# Altium project pag7936.PrjPcb
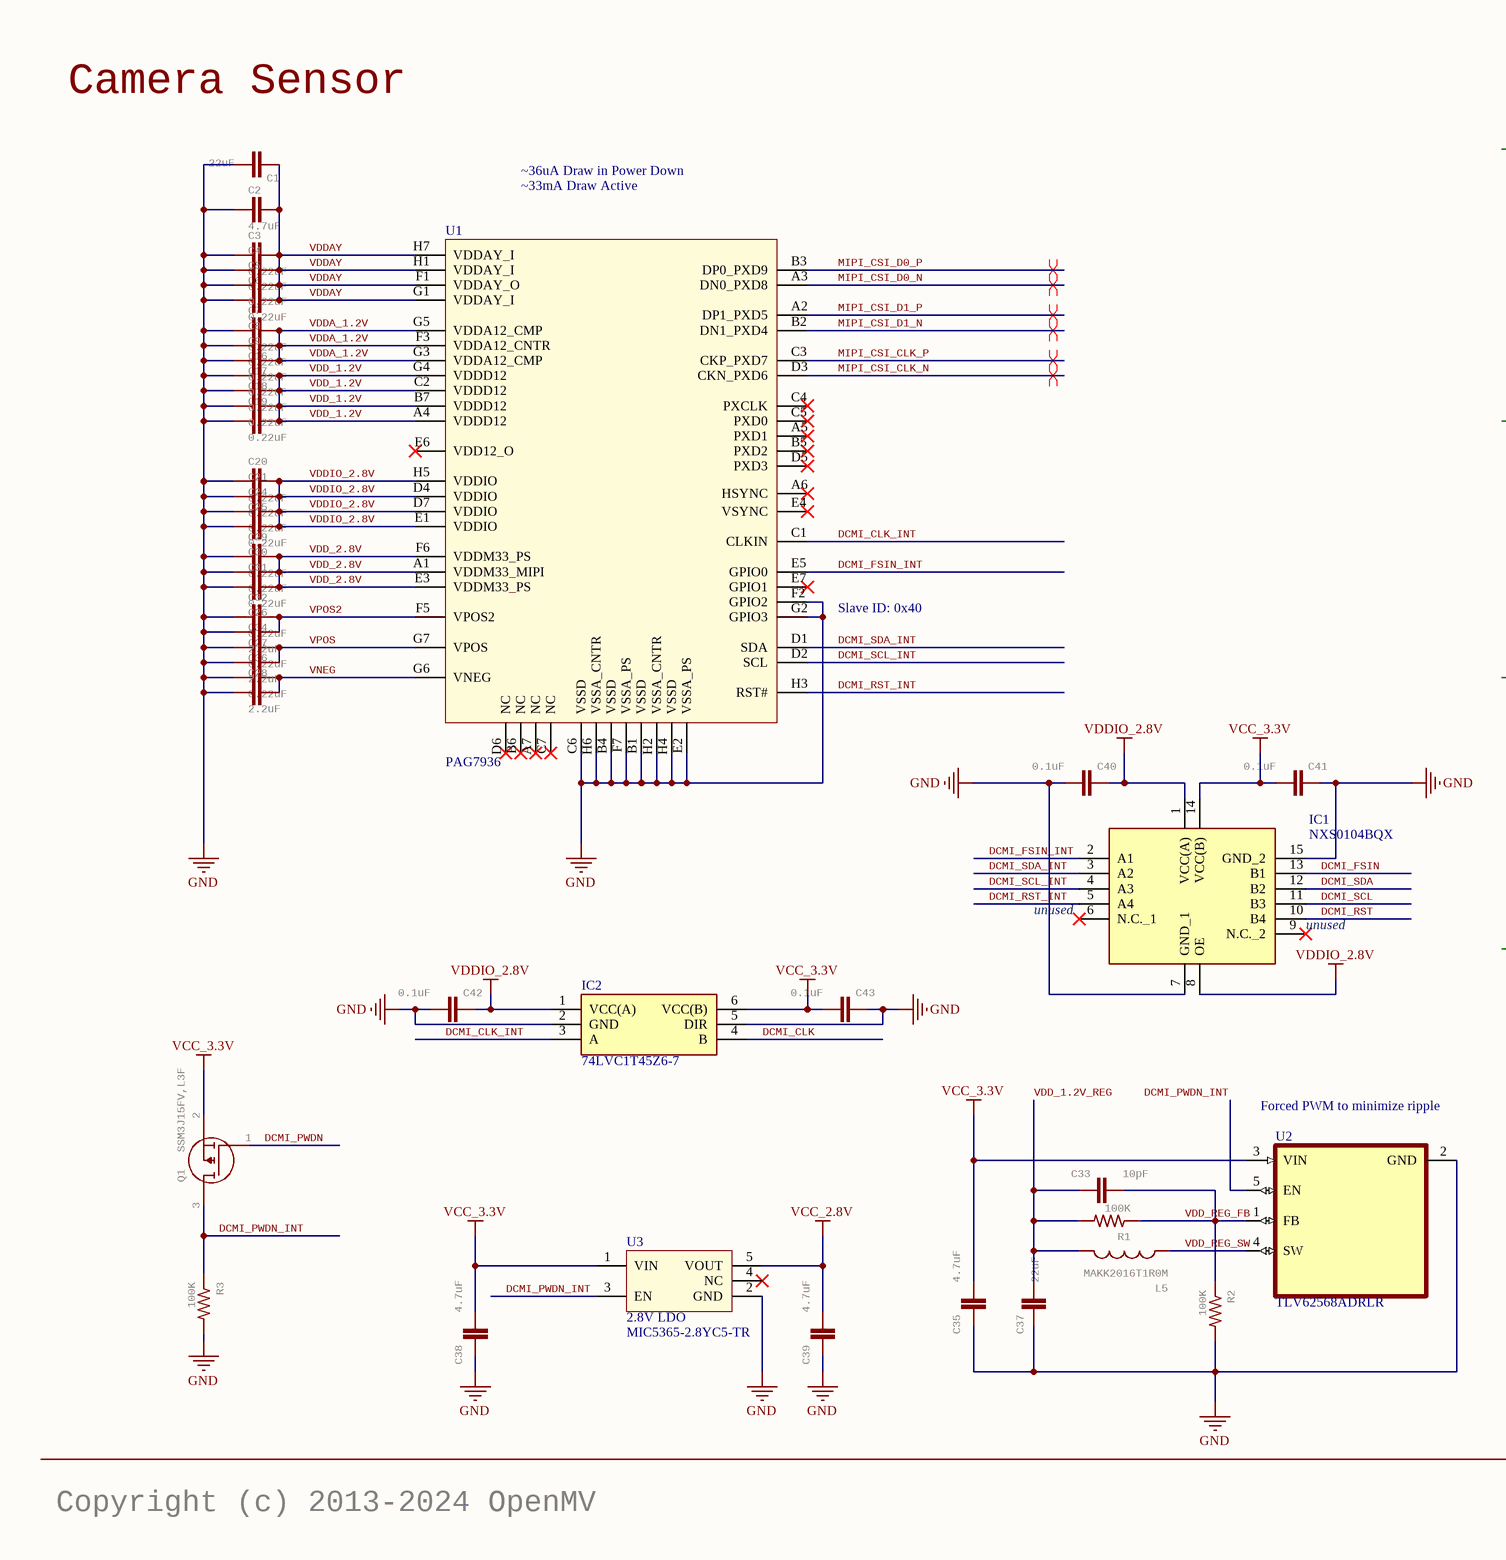
[diagram p0: pag7936.SchDoc, left]
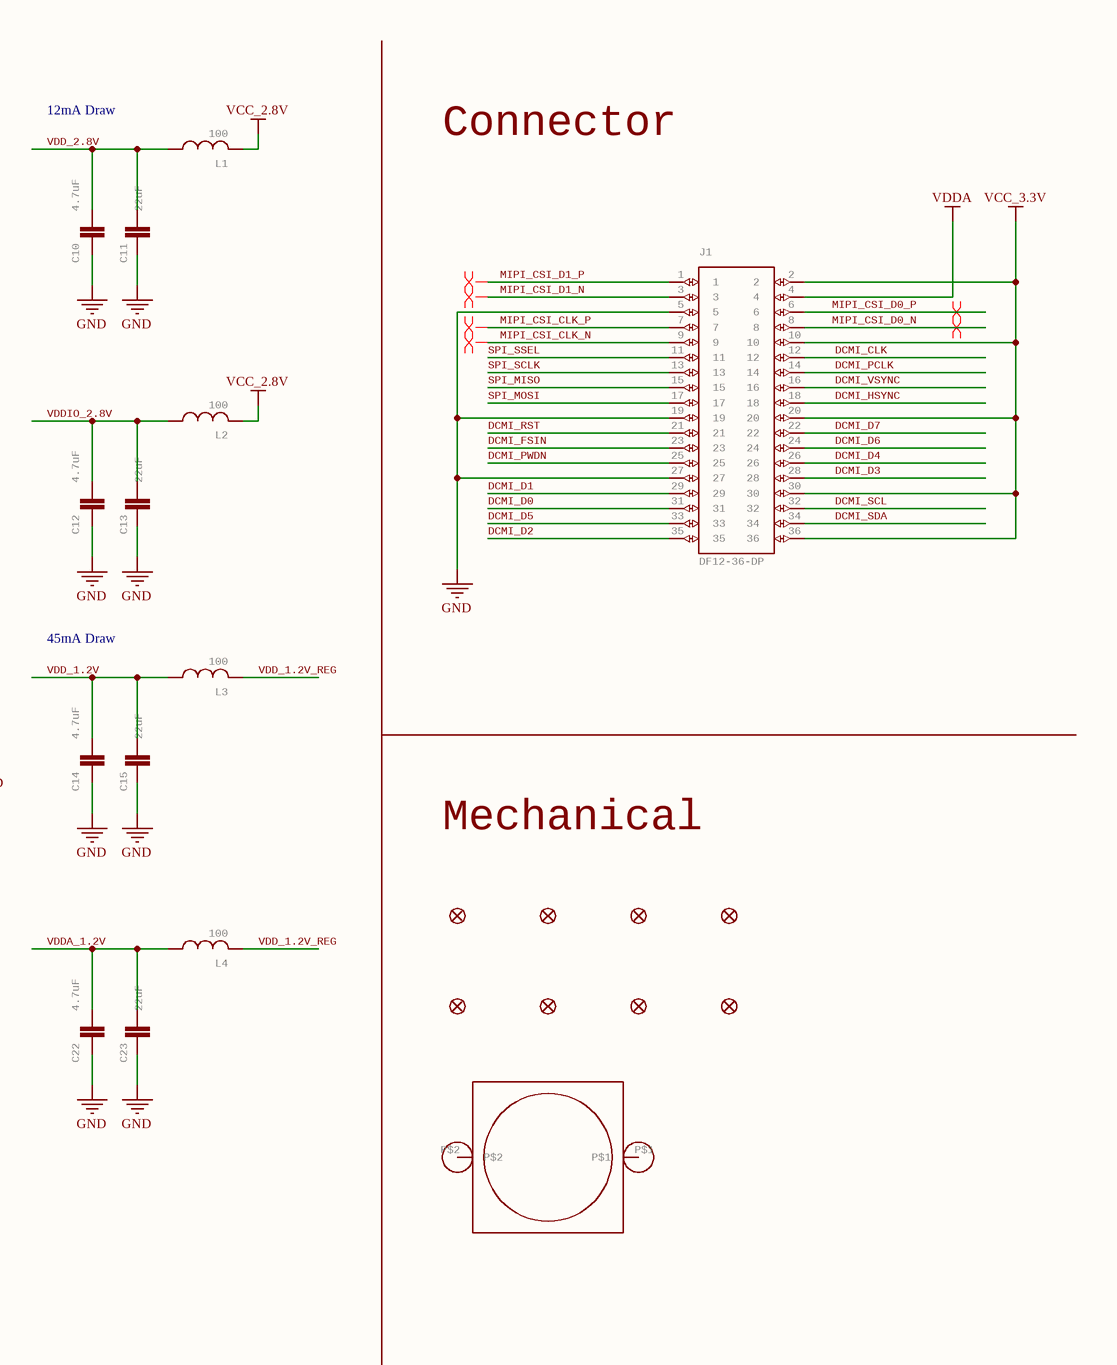
[diagram p1: pag7936.SchDoc, right]
1 sheet, 67 parts. Net scope: global (net labels, ports and power ports of the same name join across sheets).
Board file: pag7936.PcbDoc

## Sheet pag7936.SchDoc: hd-gs-alt
size 453 x 317 mm; Origin: Eagle; Date: 5/1/2023 6:37:17 AM; SheetNumber: 1; GateName_1: G$1; SymbolName_1: FRAME_B_L; LibraryName: frames; DeviceSetName: FRAME_B_L; GateName_2: G$2; SymbolName_2: DOCFIELD; Sheet: Sheet:; REV: REV:

### Parts
C1  22uF  [0805]
C2  4.7uF  [0402-CAP]
C3  0.22uF  [C0201]
C4  0.22uF  [C0201]
C5  0.22uF  [C0201]
C6  0.22uF  [C0201]
C7  0.22uF  [C0201]
C8  0.22uF  [C0201]
C9  0.22uF  [C0201]
C10  4.7uF  [0402-CAP]
C11  22uF  [0805]
C12  4.7uF  [0402-CAP]
C13  22uF  [0805]
C14  4.7uF  [0402-CAP]
C15  22uF  [0805]
C16  0.22uF  [C0201]
C17  0.22uF  [C0201]
C18  0.22uF  [C0201]
C19  0.22uF  [C0201]
C20  0.22uF  [C0201]
C21  0.22uF  [C0201]
C22  4.7uF  [0402-CAP]
C23  22uF  [0805]
C24  0.22uF  [C0201]
C25  0.22uF  [C0201]
C26  2.2uF  [0402-CAP]
C27  2.2uF  [0402-CAP]
C28  2.2uF  [0402-CAP]
C29  0.22uF  [C0201]
C30  0.22uF  [C0201]
C31  0.22uF  [C0201]
C32  0.22uF  [C0201]
C33  10pF  [0402-CAP]
C34  0.22uF  [C0201]
C35  4.7uF  [0402-CAP]
C36  0.22uF  [C0201]
C37  22uF  [0805]
C38  4.7uF  [0402-CAP]
C39  4.7uF  [0402-CAP]
C40  0.1uF  [0402-CAP]
C41  0.1uF  [0402-CAP]
C42  0.1uF  [0402-CAP]
C43  0.1uF  [0402-CAP]
FD1  FIDUCIAL1X2  [FIDUCIAL-1X2]  (value not drawn)
FD2  FIDUCIAL1X2  [FIDUCIAL-1X2]  (value not drawn)
FD3  FIDUCIAL1X2  [FIDUCIAL-1X2]  (value not drawn)
FD4  FIDUCIAL1X2  [FIDUCIAL-1X2]  (value not drawn)
FD5  FIDUCIAL1X2  [FIDUCIAL-1X2]  (value not drawn)
FD6  FIDUCIAL1X2  [FIDUCIAL-1X2]  (value not drawn)
FD7  FIDUCIAL1X2  [FIDUCIAL-1X2]  (value not drawn)
FD8  FIDUCIAL1X2  [FIDUCIAL-1X2]  (value not drawn)
H1  LENSMOUNT20MM  [LENSMOUNT-20MM]  (value not drawn)
IC1  NXS0104BQX  [NXS0104BQX]
IC2  74LVC1T45Z6-7  [74LVC1T45Z67]
J1  DF12-36-DP  [DF12-36-DP]
L1  100  [0402]
L2  100  [0402]
L3  100  [0402]
L4  100  [0402]
L5  MAKK2016T1R0M  [INDC2016X100N]
Q1  SSM3J15FV,L3F  [SSM3J15FV]
R1  100K  [R0402]
R2  100K  [R0402]
R3  100K  [R0402]
U1  PAG7936  [PAG7936]
U2  TLV62568ADRLR  [SOT50P160X60-6N]
U3  2.8V LDO  MPN: MIC5365-2.8YC5-TR  [SC70-5]

### Nets
GND: C1.2 C2.2 C3.1 C4.1 C5.1 C6.1 C7.1 C8.1 C9.1 C10.1 C11.1 C12.1 C13.1 C14.1 C15.1 C16.1 C17.1 C18.1 C19.1 C20.1 C21.1 C22.1 C23.1 C24.1 C25.1 C26.2 C27.2 C28.2 C29.1 C30.1 C31.1 C32.1 C34.1 C35.1 C36.1 C37.1 C38.1 C39.1 C40.2 C41.1 C42.2 C43.1 IC1.7(GND_1) IC1.15(GND_2) IC2.2(GND) IC2.5(DIR) J1.5 J1.19 J1.27 R2.2 R3.2 U1.B1(VSSD) U1.B4(VSSD) U1.C6(VSSD) U1.E2(VSSA_PS) U1.F2(GPIO2) U1.F7(VSSA_PS) U1.G2(GPIO3) U1.H2(VSSA_CNTR) U1.H4(VSSD) U1.H6(VSSA_CNTR) U2.2(GND) U3.2(GND)
VCC_2.8V: C39.2 L1.2(P$2) L2.2(P$2) U3.5(VOUT)
VCC_3.3V: C35.2 C38.2 C41.2 C43.2 IC1.14(VCC(B)) IC2.6(VCC(B)) J1.2 J1.10 J1.20 J1.30 J1.36 Q1.2(S) U2.3(VIN) U3.1(VIN)
VDDA: J1.4
VDDIO_2.8V: C12.2 C13.2 C20.2 C21.2 C24.2 C25.2 C40.1 C42.1 IC1.1(VCC(A)) IC1.8(OE) IC2.1(VCC(A)) L2.1(P$1) U1.D4(VDDIO) U1.D7(VDDIO) U1.E1(VDDIO) U1.H5(VDDIO)
DCMI_CLK: IC2.4(B) J1.12
DCMI_CLK_INT: IC2.3(A) U1.C1(CLKIN)
DCMI_D0: J1.31
DCMI_D1: J1.29
DCMI_D2: J1.35
DCMI_D3: J1.28
DCMI_D4: J1.26
DCMI_D5: J1.33
DCMI_D6: J1.24
DCMI_D7: J1.22
DCMI_FSIN: IC1.13(B1) J1.23
DCMI_FSIN_INT: IC1.2(A1) U1.E5(GPIO0)
DCMI_HSYNC: J1.18
DCMI_PCLK: J1.14
DCMI_PWDN: J1.25 Q1.1(G)
DCMI_PWDN_INT: Q1.3(D) R3.1 U2.5(EN) U3.3(EN)
DCMI_RST: IC1.10(B4) J1.21
DCMI_RST_INT: IC1.5(A4) U1.H3(RST#)
DCMI_SCL: IC1.11(B3) J1.32
DCMI_SCL_INT: IC1.4(A3) U1.D2(SCL)
DCMI_SDA: IC1.12(B2) J1.34
DCMI_SDA_INT: IC1.3(A2) U1.D1(SDA)
DCMI_VSYNC: J1.16
MIPI_CSI_CLK_N: J1.9 U1.D3(CKN_PXD6)
MIPI_CSI_CLK_P: J1.7 U1.C3(CKP_PXD7)
MIPI_CSI_D0_N: J1.8 U1.A3(DN0_PXD8)
MIPI_CSI_D0_P: J1.6 U1.B3(DP0_PXD9)
MIPI_CSI_D1_N: J1.3 U1.B2(DN1_PXD4)
MIPI_CSI_D1_P: J1.1 U1.A2(DP1_PXD5)
SPI_MISO: J1.15
SPI_MOSI: J1.17
SPI_SCLK: J1.13
SPI_SSEL: J1.11
VDD_1.2V: C14.2 C15.2 C16.2 C17.2 C18.2 C19.2 L3.1(P$1) U1.A4(VDDD12) U1.B7(VDDD12) U1.C2(VDDD12) U1.G4(VDDD12)
VDD_1.2V_REG: C33.1 C37.2 L3.2(P$2) L4.2(P$2) L5.2 R1.2
VDD_2.8V: C10.2 C11.2 C29.2 C30.2 C31.2 L1.1(P$1) U1.A1(VDDM33_MIPI) U1.E3(VDDM33_PS) U1.F6(VDDM33_PS)
VDD_REG_FB: C33.2 R1.1 R2.1 U2.1(FB)
VDD_REG_SW: L5.1 U2.4(SW)
VDDA_1.2V: C7.2 C8.2 C9.2 C22.2 C23.2 L4.1(P$1) U1.F3(VDDA12_CNTR) U1.G3(VDDA12_CMP) U1.G5(VDDA12_CMP)
VDDAY: C1.1 C2.1 C3.2 C4.2 C5.2 C6.2 U1.F1(VDDAY_O) U1.G1(VDDAY_I) U1.H1(VDDAY_I) U1.H7(VDDAY_I)
VNEG: C28.1 C36.2 U1.G6(VNEG)
VPOS: C27.1 C34.2 U1.G7(VPOS)
VPOS2: C26.1 C32.2 U1.F5(VPOS2)

Not connected (* = marked no-connect by the designer): H1 P$1 P$2; IC1 6(N.C._1)* 9(N.C._2)*; U1 A5(PXD1)* A6(HSYNC)* A7(NC)* B5(PXD2)* B6(NC)* C4(PXCLK)* C5(PXD0)* C7(NC)* D5(PXD3)* D6(NC)* E4(VSYNC)* E6(VDD12_O)* E7(GPIO1)*; U3 4(NC)*

### Layout directives
differential pair; differential pair class MIPI: MIPI_CSI_CLK_N, MIPI_CSI_CLK_P, MIPI_CSI_D0_N, MIPI_CSI_D0_P, MIPI_CSI_D1_N, MIPI_CSI_D1_P
differential pair: MIPI_CSI_CLK_N, MIPI_CSI_CLK_P, MIPI_CSI_D0_N, MIPI_CSI_D0_P, MIPI_CSI_D1_N, MIPI_CSI_D1_P

### Notes on the sheet
- Camera Sensor
- 12mA Draw
- ~36uA Draw in Power Down
- ~33mA Draw Active
- Connector
- Slave ID: 0x40
- 45mA Draw
- Mechanical
- (near IC1) unused
- (near U2) Forced PWM to minimize ripple
- Copyright (c) 2013-2024 OpenMV

### Library data of the parts
C1 C11 C13 C15 C23 C37 = 22UF-0805-6.3V-20%: 22ÂµF ceramic capacitors    A capacitor is a passive two-terminal electrical component used to store electrical energy temporarily in an electric field.; MPN: CL21A226MQQNNNE; GateName_1: G$1; SymbolName_1: CAP; PROD_ID: CAP-08402; DeviceName: -0805-6.3V-20%; LibraryName: SparkFun-Capacitors; DeviceSetName: 22UF
C2 = CAP0402-CAP: CapacitorStandard 0603 ceramic capacitor, and 0.1" leaded capacitor.; MPN: JMK105BBJ475MV-F; GateName_1: G$1; SymbolName_1: CAP; DeviceName: 0402-CAP; LibraryName: sfe; DeviceSetName: CAP; Part Number: JMK105BBJ475MV-F
C3-C9 C16-C21 C24 C25 C29-C32 C34 C36 = C-EUC0201: CAPACITOR, European symbol; MPN: GRM033R60J224ME15D; GateName_1: G$1; SymbolName_1: C-EU; POPULARITY: 0; DeviceName: C0201; LibraryName: rcl; DeviceSetName: C-EU; SPICEPREFIX: C; Part Number: GRM033R60J224ME15D
C10 C12 C14 C22 C35 C38 C39 = CAP_0402: 0402 (1005 Metric) Nick Garner - TeleSense; MPN: JMK105BBJ475MV-F; GateName_1: G$1; SymbolName_1: CAP; LibraryName: 0402; DeviceSetName: CAP_0402
C26-C28 = CAP0402-CAP: CapacitorStandard 0603 ceramic capacitor, and 0.1" leaded capacitor.; MPN: CL05A225MQ5NNNC; GateName_1: G$1; SymbolName_1: CAP; DeviceName: 0402-CAP; LibraryName: sfe; DeviceSetName: CAP; Part Number: CL05A225MQ5NNNC
C33 = CAP_0402: 0402 (1005 Metric) Nick Garner - TeleSense; MPN: 0402N100D500CT; GateName_1: G$1; SymbolName_1: CAP; LibraryName: 0402; DeviceSetName: CAP_0402
C40-C43 = C-EUC0201: CAPACITOR, European symbol; MPN: C0402C104Z4VAC; GateName_1: G$1; SymbolName_1: C-EU; POPULARITY: 0; LibraryName: rcl; DeviceSetName: C-EU; SPICEPREFIX: C; Part Number: C0402C104Z4VAC
FD1-FD8 = FIDUCIAL1X2: Fiducial Alignment Points    Point-of-reference for pick-and-place machines and other optical instruments.; GateName_1: G$1; DeviceName: 1X2; SymbolName_1: FIDUCIAL; LibraryName: SparkFun-Aesthetics; DeviceSetName: FIDUCIAL
H1 = LENSMOUNT20MM: GateName_1: G$1; SymbolName_1: LENS; DeviceName: 20MM; LibraryName: lensmount; DeviceSetName: LENSMOUNT
IC1 = CMP-057-000000-1: NXS0104 - Dual supply translating transceiver; open drain; autodirectionsensing@en-us; Manufacturer_Name: Nexperia; Height: 1mm; Source: SamacSys.SchLib; Mouser Part Number: 771-NXS0104BQX; Manufacturer_Part_Number: NXS0104BQX; Datasheet Link: https://assets.nexperia.com/documents/data-sheet/NXS0104.pdf; Mouser Price/Stock: https://www.mouser.co.uk/ProductDetail/Nexperia/NXS0104BQX?qs=2WXlatMagcEya%2F7vq6wExg%3D%3D; Design Item ID: NXS0104BQX; <PN: NXS0104BQX; Part Number: NXS0104BQX; MPN: NXS0104BQX
IC2 = 74LVC1T45Z6-7: Integrated Circuit; Manufacturer_Name: Diodes Incorporated; Datasheet Link: https://www.diodes.com//assets/Datasheets/74LVC1T45.pdf; Height: 0.6mm; Manufacturer_Part_Number: 74LVC1T45Z6-7; Mouser Part Number: 621-74LVC1T45Z6-7; Mouser Price/Stock: https://www.mouser.co.uk/ProductDetail/Diodes-Incorporated/74LVC1T45Z6-7?qs=Oxncjon6mbri043VV7aCkA%3D%3D; Arrow Part Number: 74LVC1T45Z6-7; Arrow Price/Stock: https://www.arrow.com/en/products/74lvc1t45z6-7/diodes-incorporated?region=nac
J1 = DF12-36-DP: MPN: DF12NB(3.0)-36DP-0.5V(51); GateName_1: G$1; SymbolName_1: DF12-36; LibraryName: DF12NB(3.0)-36DP-0.5V(51); DeviceSetName: DF12-36-DP
L1-L4 = INDUCTOR_0402: MPN: MFBM1V1005-101-R; GateName_1: G$1; SymbolName_1: INDUCTOR; LibraryName: 0402; DeviceSetName: INDUCTOR_0402
L5 = MAKK2016T1R0M: Ind Power Wirewound 1uH 20% 2MHz Metal 2200mA 0806 Check availability; GateName_1: G$1; MF: Taiyo Yuden; SymbolName_1: MAKK2016T1R0M; LibraryName: MAKK2016T1R0M; DeviceSetName: MAKK2016T1R0M; AVAILABILITY: In Stock; MP: MAKK2016T1R0M; MPN: MAKK2016T1R0M; PACKAGE: 2016 Taiyo Yuden; PRICE: None; PURCHASE-URL: https://pricing.snapeda.com/search/part/MAKK2016T1R0M/?ref=eda; Part Number: MAKK2016T1R0M
Q1 = PMXB120EPEZ: MOSFET 30 V, P-channel Trench MOSFET   Source:  Datasheet; GateName_1: G$1; SymbolName_1: SSM3J15FV,L3F; LibraryName: SSM3J15FV,L3F; DeviceSetName: SSM3J15FV,L3F; HEIGHT: 0.4mm; MANUFACTURER_PART_NUMBER: SSM3J15FV,L3F; MOUSER_PART_NUMBER: SSM3J15FV,L3F; MPN: SSM3J15FV,L3F
R1-R3 = R-US_R0402: RESISTOR, American symbol; MPN: AC0402FR-07100KL; GateName_1: G$1; SymbolName_1: R-US; DeviceSetName: R-US_; POPULARITY: 34; DeviceName: R0402; LibraryName: rcl; SPICEPREFIX: R
U1 = PAG7936: MF: PixArt; MPN: PAG7936
U2 = CMP-052-000000-1: 2.5V-5.5V input, 1A high efficiency step-down buck converter with forced PWM in small SOT563 package 6-SOT-5X3 -40 to 125; MF: Texas Instruments; Purchase-URL: https://pricing.snapeda.com/search/part/TLV62568ADRLR/?ref=eda; Package: SOT-5X3-6 Texas Instruments; MP: TLV62568ADRLR; Value: *; Price: None; Component Type: Standard; SnapEDA_Link: https://www.snapeda.com/parts/TLV62568ADRLR/Texas%20Instruments/view-part/2776350/?ref=snap; Pin Count: 5; Availability: Good; Design Item ID: TLV62568ADRLR; Source: TLV62568ADRLR.SchLib; Check_prices: https://www.snapeda.com/parts/TLV62568ADRLR/Texas%20Instruments/view-part/2776350/?ref=eda; MPN: TLV62568ADRLR; Part Number: TLV62568ADRLR
U3 = MIC5365-3.3YC5-TR: MF: Microchip; Part Number: MIC5365-2.8YC5-TR